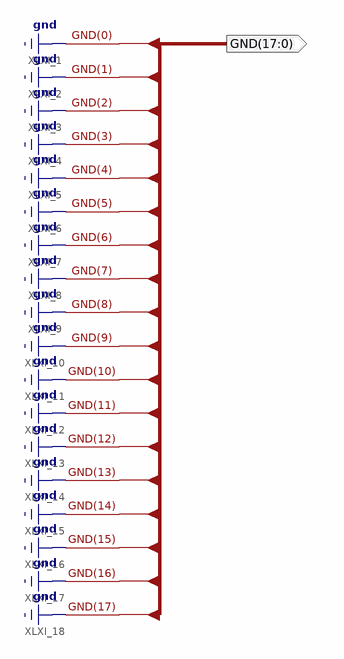
[diagram p0: schematic sheet 1]
// Xilinx ISE schematic gnd18.sch (spartan6) as structural Verilog: 0 symbols, 1 ports
module gnd18 (
  output [17:0] GND
);


  assign GND = {18{1'b0}};
endmodule
